# Altium schematic sheet EA3501.SchDoc
size A; SheetNumber: 1; SheetTotal: 1
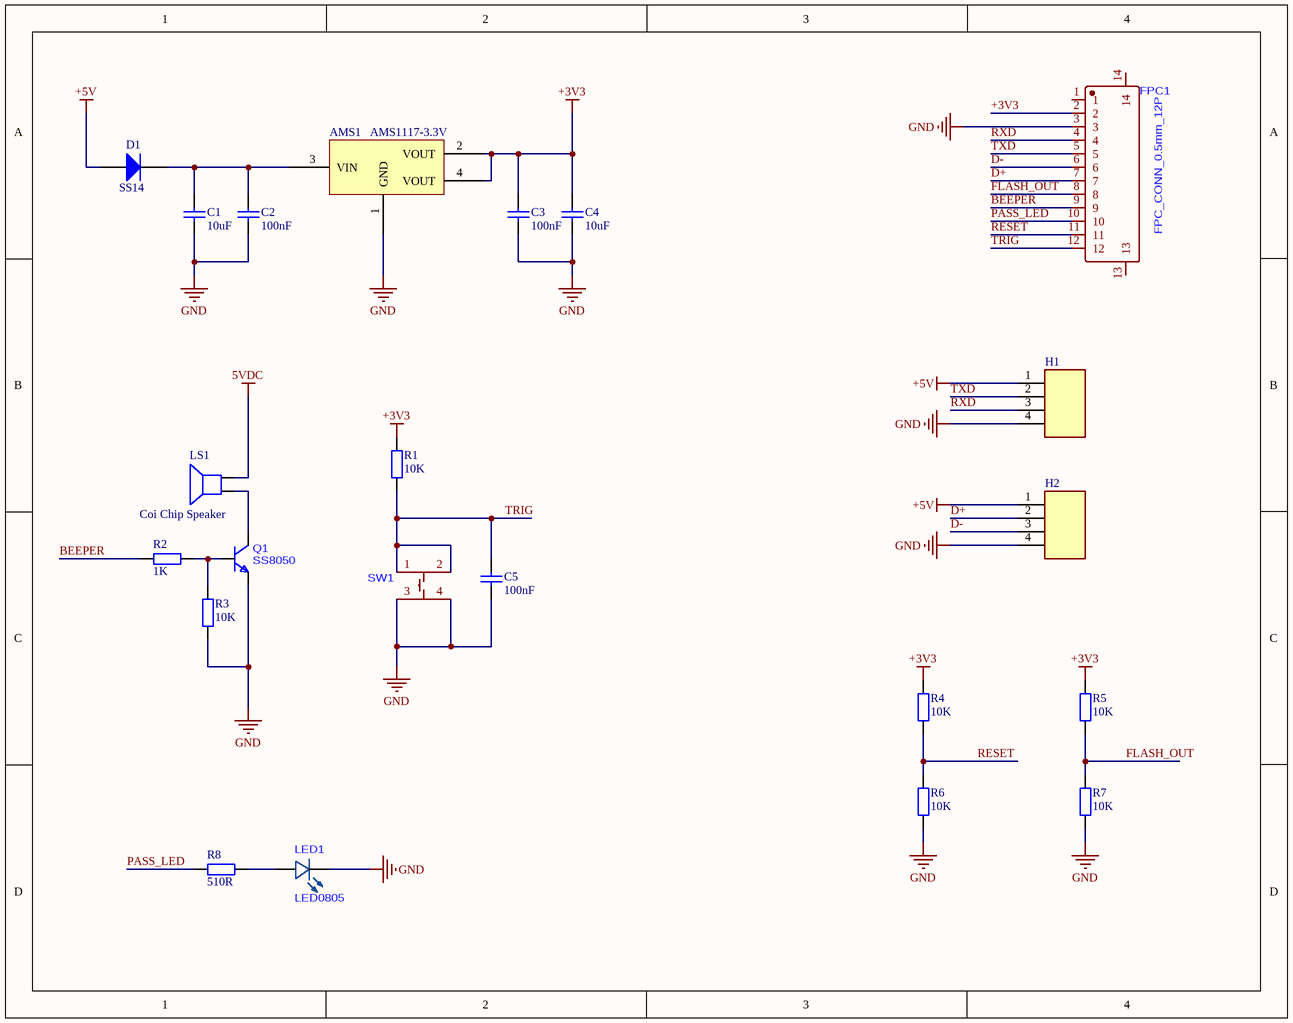
[diagram p0: EA3501.SchDoc]

## Parts
AMS1  AMS1117-3.3V  [SOT223]
C1  10uF  [Cap0603]
C2  100nF  [Cap0603]
C3  100nF  [Cap0603]
C4  10uF  [Cap0603]
C5  100nF  [Cap0603]
D1  SS14  [SMA(DO-214AC)]
FPC1  FPC_CONN_0.5mm_12P  [FPC-SMD_12P-P0.50_FPC-05F-12PH20]
H1  CONN_HDR_4P_1.25  [CONN_HDR_4P_1.25mm]  (value not drawn)
H2  CONN_HDR_4P_1.25  [CONN_HDR_4P_1.25mm]  (value not drawn)
LED1  LED0805  [LED0805-GR]
LS1  Coi Chip Speaker  [Coi Chip Speacker]
Q1  SS8050  [SOT-23]
R1  10K  [R0603]
R2  1K  [R0603]
R3  10K  [R0603]
R4  10K  [R0603]
R5  10K  [R0603]
R6  10K  [R0603]
R7  10K  [R0603]
R8  510R  [R0603]
SW1  SW_4P_  [SW-SMD_4P-L5.1-W5.1-P3.70-LS6.4_YZA-044-1.5]  (value not drawn)

## Nets
5VDC: LS1.2
+3V3: AMS1.2(VOUT) AMS1.4(VOUT) C3.1 C4.1 FPC1.2 R1.2 R4.2 R5.2
+5V: D1.1(A) H1.1 H2.1
GND: AMS1.1(GND) C1.2 C2.2 C3.2 C4.2 C5.2 FPC1.3 H1.4 H2.4 LED1.1(-) Q1.2(E) R3.1 R6.2 R7.2 SW1.3(C) SW1.4(D)
BEEPER: FPC1.9 R2.1
D+: FPC1.7 H2.2
D-: FPC1.6 H2.3
FLASH_OUT: FPC1.8 R5.1 R7.1
PASS_LED: FPC1.10 R8.1
RESET: FPC1.11 R4.1 R6.1
RXD: FPC1.4 H1.3
TRIG: C5.1 FPC1.12 R1.1 SW1.1(A) SW1.2(B)
TXD: FPC1.5 H1.2
NetAMS1_3: AMS1.3(VIN) C1.1 C2.1 D1.2(K)
NetLED1_2: LED1.2(+) R8.2
NetLS1_1: LS1.1 Q1.3(C)
NetQ1_1: Q1.1(B) R2.2 R3.2

Not connected (* = marked no-connect by the designer): FPC1 1 13 14

## Library data of the parts
AMS1 = AMS1117 SMD: Dán; Value: AMS1117-3.3V SOT223; Don_Vi: Con; Ma_Hang: MH000596; Ghi_Chu: *; Kieu_Chan: *; Chung_Loai: Dán
C1-C5 = Cap 0603: Capacitor SMD 0603
D1 = DIODE
LS1 = Coi Chip Speaker: Còi chip
R1 R3-R7 = RES 0603: RES SMD 0603; Manufacturer: Vishay Dale; Manufacturer Part Number: CRCW040210K0FKED; Tolerance: ±1%; Power (Watts): 0.063W, 1/16W; Temperature Coefficient: ±100ppm/°C; Supplier 1: Digi-Key; RoHS: RoHS Compliant; Category: Resistors; Stock 1: 2392462; Pricing 1: 10=0.083, 50=0.0444, 200=0.0255, 1000=0.0174 (USD); Packaging: Cut Tape (CT); Resistance (Ohms): 10k; Composition: Thick Film; Features: Automotive AEC-Q200; Operating Temperature: -55°C ~ 155°C; Package / Case: 0402 (1005 Metric); Supplier Device Package: 0402 (1005 Metric); Size / Dimension: 0.039" L x 0.020" W (1.00mm x 0.50mm); Height: 0.016" (0.40mm); Number of Terminations: 2; ComponentLink1URL: http://www.vishay.com/docs/20035/dcrcwe3.pdf; ComponentLink1Description: http://www.vishay.com/docs/20035/dcrcwe3.pdf; Supplier Part Number 1: 541-10.0KLCT-ND
R2 R8 = RES 0603: RES SMD 0603; Manufacturer: Vishay Dale; Manufacturer Part Number: CRCW040210K0FKED; Resistance (Ohms): 10k; Tolerance: ±1%; Power (Watts): 0.063W, 1/16W; Temperature Coefficient: ±100ppm/°C; Supplier 1: Digi-Key; RoHS: RoHS Compliant; Category: Resistors; Stock 1: 2392462; Pricing 1: 10=0.083, 50=0.0444, 200=0.0255, 1000=0.0174 (USD); Packaging: Cut Tape (CT); Composition: Thick Film; Features: Automotive AEC-Q200; Operating Temperature: -55°C ~ 155°C; Package / Case: 0402 (1005 Metric); Supplier Device Package: 0402 (1005 Metric); Size / Dimension: 0.039" L x 0.020" W (1.00mm x 0.50mm); Height: 0.016" (0.40mm); Number of Terminations: 2; ComponentLink1URL: http://www.vishay.com/docs/20035/dcrcwe3.pdf; ComponentLink1Description: http://www.vishay.com/docs/20035/dcrcwe3.pdf; Supplier Part Number 1: 541-10.0KLCT-ND